# EAGLE design zeta2rework_lw_v26_fixes_wompu (EAGLE 9.0.1)
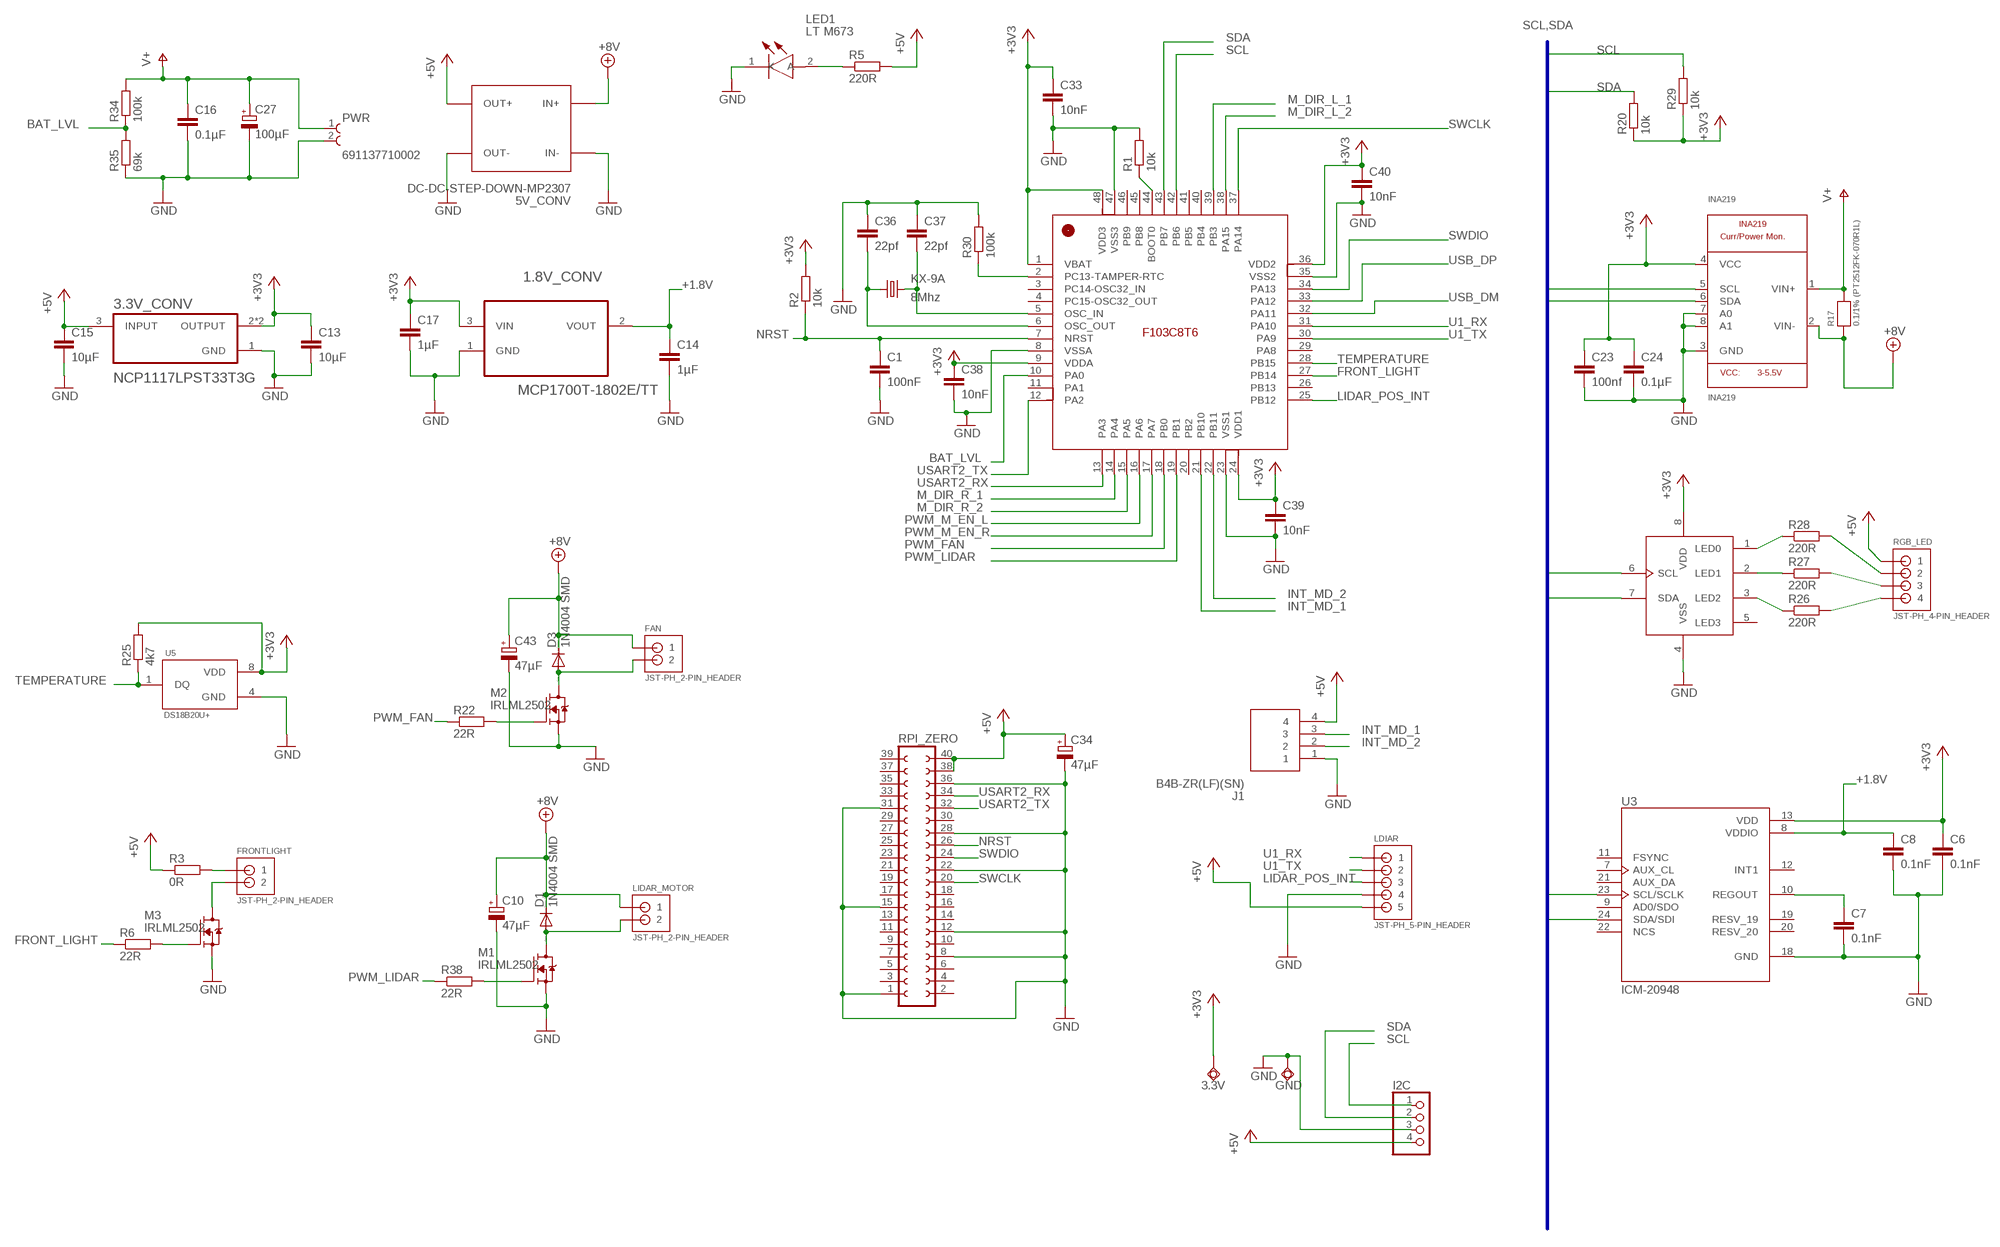
[diagram p0: schematic, sheet 1, part 1 of 2]
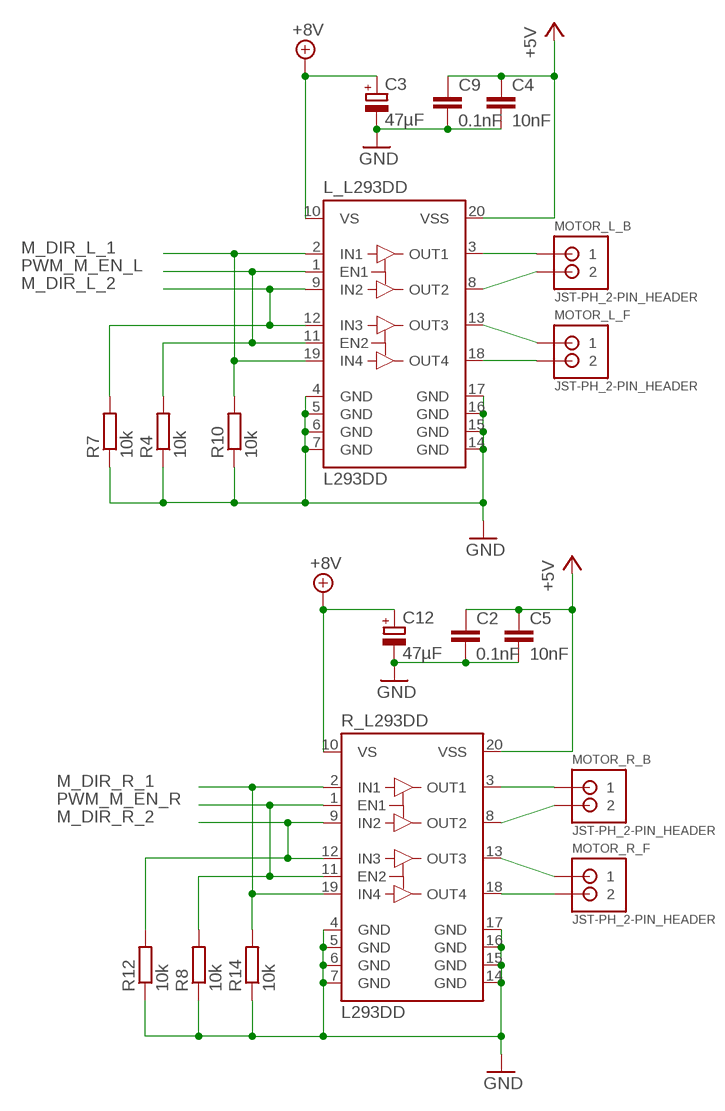
[diagram p1: schematic, sheet 1, part 2 of 2]

## Parts
1.8V_CONV  MCP1700T-1802E/TT  MCP1700T-2102E/TT  [SOT95P237X112-3N]
3.3V  TPSQTP20R  [TP20R]
3.3V_CONV  NCP1117LPST33T3G  [SOT230P700X175-4N]
5V_CONV  DC-DC-STEP-DOWN-MP2307  [DC-DC-STEP-DOWN-MP2307]
C1  100nF  C-EUC1206  [C1206]
C2  0.1nF  C-EUC1206  [C1206]
C3  47µF  CPOL-EUUD-5X5,8  [UD-5X5,8_NICHICON]
C4  10nF  C-EUC1206  [C1206]
C5  10nF  C-EUC1206  [C1206]
C6  0.1nF  C-EUC1206  [C1206]
C7  0.1nF  C-EUC1206  [C1206]
C8  0.1nF  C-EUC1206  [C1206]
C9  0.1nF  C-EUC1206  [C1206]
C10  47µF  CPOL-EUUD-5X5,8  [UD-5X5,8_NICHICON]
C12  47µF  CPOL-EUUD-5X5,8  [UD-5X5,8_NICHICON]
C13  10µF  C-EUC1206  [C1206]
C14  1µF  C-EUC1206  [C1206]
C15  10µF  C-EUC1206  [C1206]
C16  0.1µF  C-EUC1206  [C1206]
C17  1µF  C-EUC1206  [C1206]
C23  100nf  C-EUC1206  [C1206]
C24  0.1µF  C-EUC1206  [C1206]
C27  100µF  CPOL-EUUD-5X5,8  [UD-5X5,8_NICHICON]
C33  10nF  C-EUC1206  [C1206]
C34  47µF  CPOL-EUUD-5X5,8  [UD-5X5,8_NICHICON]
C36  22pf  C-EUC1206  [C1206]
C37  22pf  C-EUC1206  [C1206]
C38  10nF  C-EUC1206  [C1206]
C39  10nF  C-EUC1206  [C1206]
C40  10nF  C-EUC1206  [C1206]
C43  47µF  CPOL-EUUD-5X5,8  [UD-5X5,8_NICHICON]
D1  1N4004 SMD  DIODE-DO214AC  [DO214AC]
D3  1N4004 SMD  DIODE-DO214AC  [DO214AC]
FAN  JST-PH_2-PIN_HEADER  [JST_B2B-PH_HEADER]
FRONTLIGHT  JST-PH_2-PIN_HEADER  [JST_B2B-PH_HEADER]
GND  TPSQTP20R  [TP20R]
I2C  PINHD-1X4  [1X04]
INA219  INA219  [SOT23-8]
J1  B4B-ZR(LF)(SN)  [SHDR4W50P0X150_1X4_750X350X450]
KX-9A  8Mhz  KX-9A  [5.0X3.2_KX-9A]
L_L293DD  L293DD  [SO20]
LDIAR  JST-PH_5-PIN_HEADER  [JST_B5B-PH_HEADER]
LED1  LT M673  LT_M673-N1R2-25  [LTM673-N1R2-25]
LIDAR_MOTOR  JST-PH_2-PIN_HEADER  [JST_B2B-PH_HEADER]
M1  IRLML2502  IRLML2502TRPBF  [SOT23]
M2  IRLML2502  IRLML2502TRPBF  [SOT23]
M3  IRLML2502  IRLML2502TRPBF  [SOT23]
MOTOR_L_B  JST-PH_2-PIN_HEADER  [JST_B2B-PH_HEADER]
MOTOR_L_F  JST-PH_2-PIN_HEADER  [JST_B2B-PH_HEADER]
MOTOR_R_B  JST-PH_2-PIN_HEADER  [JST_B2B-PH_HEADER]
MOTOR_R_F  JST-PH_2-PIN_HEADER  [JST_B2B-PH_HEADER]
PCA9533  PCA9533  [SOIC8]
PWR  691137710002  [691137710002]
R1  10k  R-EU_R0603  [R0603]
R2  10k  R-EU_R0603  [R0603]
R3  0R  R-EU_R0603  [R0603]
R4  10k  R-EU_R0603  [R0603]
R5  220R  R-EU_R0603  [R0603]
R6  22R  R-EU_R0603  [R0603]
R7  10k  R-EU_R0603  [R0603]
R8  10k  R-EU_R0603  [R0603]
R10  10k  R-EU_R0603  [R0603]
R12  10k  R-EU_R0603  [R0603]
R14  10k  R-EU_R0603  [R0603]
R17  0.1/1% (PT2512FK-070R1L)  RESISTOR2512  [2512]
R20  10k  R-EU_R0603  [R0603]
R22  22R  R-EU_R0603  [R0603]
R25  4k7  R-EU_R0603  [R0603]
R26  220R  R-EU_R0603  [R0603]
R27  220R  R-EU_R0603  [R0603]
R28  220R  R-EU_R0603  [R0603]
R29  10k  R-EU_R0603  [R0603]
R30  100k  R-EU_R0603  [R0603]
R34  100k  R-EU_R0603  [R0603]
R35  69k  R-EU_R0603  [R0603]
R38  22R  R-EU_R0603  [R0603]
R_L293DD  L293DD  [SO20]
RGB_LED  JST-PH_4-PIN_HEADER  [JST_B4B-PH_HEADER]
RPI_ZERO  FE20-2  [FE20-2]
STM32F103CB  STM32F103CB  STM32F103C8T6  [LQFP48_7X7MM_0.5MMPP]
U3  ICM-20948  [QFN40P300X300X105-25N]
U5  DS18B20U+  [SOP65P490X95-8N]

## Nets
+1.8V: 1.8V_CONV.2(VOUT) C8.1 C14.1 U3.8(VDDIO)
+3V3: 1.8V_CONV.3(VIN) 3.3V.TP 3.3V_CONV.2(OUTPUT) 3.3V_CONV.4(OUTPUT) C6.1 C13.1 C17.1 C23.1 C24.1 C33.1 C38.1 C39.1 C40.1 INA219.4(VCC) PCA9533.8(VDD) R2.2 R20.1 R25.2 R29.1 STM32F103CB.1(VBAT) STM32F103CB.9(VDDA) STM32F103CB.24(VDD1) STM32F103CB.36(VDD2) STM32F103CB.48(VDD3) U3.13(VDD) U5.8(VDD)
+5V: 3.3V_CONV.3(INPUT) 5V_CONV.OUT+ C2.1 C4.1 C5.1 C9.1 C15.1 C34.+ I2C.4 J1.4 L_L293DD.20(VSS) LDIAR.P5 R3.1 R5.2 R_L293DD.20(VSS) RGB_LED.P1 RPI_ZERO.38 RPI_ZERO.40
+8V: 5V_CONV.IN+ C3.+ C10.+ C12.+ C43.+ D1.C D3.C FAN.P1 INA219.2(VIN-) L_L293DD.10(VS) LIDAR_MOTOR.P1 R17.1 R_L293DD.10(VS)
BAT_LVL: R34.1 R35.2 STM32F103CB.10(PA0)
FRONT_LIGHT: R6.1 STM32F103CB.27(PB14)
GND: 1.8V_CONV.1(GND) 3.3V_CONV.1(GND) 5V_CONV.IN- 5V_CONV.OUT- C1.2 C2.2 C3.- C4.2 C5.2 C6.2 C7.2 C8.2 C9.2 C10.- C12.- C13.2 C14.2 C15.2 C16.2 C17.2 C23.2 C24.2 C27.- C33.2 C34.- C36.1 C37.1 C38.2 C39.2 C40.2 C43.- GND.TP I2C.3 INA219.3(GND) INA219.7(A0) INA219.8(A1) J1.1 L_L293DD.4(GND) L_L293DD.5(GND) L_L293DD.6(GND) L_L293DD.7(GND) L_L293DD.14(GND) L_L293DD.15(GND) L_L293DD.16(GND) L_L293DD.17(GND) LDIAR.P4 LED1.1(K) M1.2(S) M2.2(S) M3.2(S) PCA9533.4(VSS) PWR.2 R1.2 R4.1 R7.1 R8.1 R10.1 R12.1 R14.1 R30.2 R35.1 R_L293DD.4(GND) R_L293DD.5(GND) R_L293DD.6(GND) R_L293DD.7(GND) R_L293DD.14(GND) R_L293DD.15(GND) R_L293DD.16(GND) R_L293DD.17(GND) RPI_ZERO.1 RPI_ZERO.8 RPI_ZERO.12 RPI_ZERO.15 RPI_ZERO.22 RPI_ZERO.28 RPI_ZERO.31 RPI_ZERO.36 STM32F103CB.8(VSSA) STM32F103CB.23(VSS1) STM32F103CB.35(VSS2) STM32F103CB.47(VSS3) U3.18(GND) U5.4(GND)
INT_MD_1: J1.3 STM32F103CB.21(PB10)
INT_MD_2: J1.2 STM32F103CB.22(PB11)
LIDAR_POS_INT: LDIAR.P3 STM32F103CB.25(PB12)
M_DIR_L_1: L_L293DD.2(IN1) L_L293DD.19(IN4) R10.2 STM32F103CB.39(PB3)
M_DIR_L_2: L_L293DD.9(IN2) L_L293DD.12(IN3) R7.2 STM32F103CB.38(PA15)
M_DIR_R_1: R14.2 R_L293DD.2(IN1) R_L293DD.19(IN4) STM32F103CB.14(PA4)
M_DIR_R_2: R12.2 R_L293DD.9(IN2) R_L293DD.12(IN3) STM32F103CB.15(PA5)
N$1: MOTOR_R_B.P2 R_L293DD.8(OUT2)
N$2: MOTOR_R_F.P2 R_L293DD.18(OUT4)
N$3: MOTOR_R_F.P1 R_L293DD.13(OUT3)
N$4: L_L293DD.18(OUT4) MOTOR_L_F.P2
N$5: R1.1 STM32F103CB.44(BOOT0)
N$6: FRONTLIGHT.P1 R3.2
N$7: LED1.2(A) R5.1
N$8: C7.1 U3.10(REGOUT)
N$9: FRONTLIGHT.P2 M3.3(D)
N$10: M3.1(G) R6.2
N$16: L_L293DD.13(OUT3) MOTOR_L_F.P1
N$17: L_L293DD.8(OUT2) MOTOR_L_B.P2
N$18: L_L293DD.3(OUT1) MOTOR_L_B.P1
N$22: PCA9533.3(LED2) R26.1
N$23: PCA9533.2(LED1) R27.1
N$24: PCA9533.1(LED0) R28.1
N$26: MOTOR_R_B.P1 R_L293DD.3(OUT1)
N$31: R26.2 RGB_LED.P4
N$33: R27.2 RGB_LED.P3
N$35: R28.2 RGB_LED.P2
N$37: M2.1(G) R22.2
N$38: M1.1(G) R38.2
N$39: D1.A LIDAR_MOTOR.P2 M1.3(D)
N$46: C36.2 KX-9A.1 STM32F103CB.6(OSC_OUT)
N$47: C37.2 KX-9A.3 STM32F103CB.5(OSC_IN)
N$49: R30.1 STM32F103CB.2(PC13-TAMPER-RTC)
N$55: D3.A FAN.P2 M2.3(D)
NRST: C1.1 R2.1 RPI_ZERO.26 STM32F103CB.7(NRST)
PWM_FAN: R22.1 STM32F103CB.18(PB0)
PWM_LIDAR: R38.1 STM32F103CB.19(PB1)
PWM_M_EN_L: L_L293DD.1(EN1) L_L293DD.11(EN2) R4.2 STM32F103CB.16(PA6)
PWM_M_EN_R: R8.2 R_L293DD.1(EN1) R_L293DD.11(EN2) STM32F103CB.17(PA7)
SCL: I2C.1 INA219.5(SCL) PCA9533.6(SCL) R29.2 STM32F103CB.42(PB6) U3.23(SCL/SCLK)
SDA: I2C.2 INA219.6(SDA) PCA9533.7(SDA) R20.2 STM32F103CB.43(PB7) U3.24(SDA/SDI)
SWCLK: RPI_ZERO.20 STM32F103CB.37(PA14)
SWDIO: RPI_ZERO.24 STM32F103CB.34(PA13)
TEMPERATURE: R25.1 STM32F103CB.28(PB15) U5.1(DQ)
U1_RX: LDIAR.P1 STM32F103CB.31(PA10)
U1_TX: LDIAR.P2 STM32F103CB.30(PA9)
USART2_RX: RPI_ZERO.34 STM32F103CB.13(PA3)
USART2_TX: RPI_ZERO.32 STM32F103CB.12(PA2)
USB_DM: STM32F103CB.32(PA11)
USB_DP: STM32F103CB.33(PA12)
V+: C16.1 C27.+ INA219.1(VIN+) PWR.1 R17.2 R34.2
Unconnected: PCA9533.5(LED3) RPI_ZERO.2 RPI_ZERO.3 RPI_ZERO.4 RPI_ZERO.5 RPI_ZERO.6 RPI_ZERO.7 RPI_ZERO.9 RPI_ZERO.10 RPI_ZERO.11 RPI_ZERO.13 RPI_ZERO.14 RPI_ZERO.16 RPI_ZERO.17 RPI_ZERO.18 RPI_ZERO.19 RPI_ZERO.21 RPI_ZERO.23 RPI_ZERO.25 RPI_ZERO.27 RPI_ZERO.29 RPI_ZERO.30 RPI_ZERO.33 RPI_ZERO.35 RPI_ZERO.37 RPI_ZERO.39 STM32F103CB.3(PC14-OSC32_IN) STM32F103CB.4(PC15-OSC32_OUT) STM32F103CB.11(PA1) STM32F103CB.20(PB2) STM32F103CB.26(PB13) STM32F103CB.29(PA8) STM32F103CB.40(PB4) STM32F103CB.41(PB5) STM32F103CB.45(PB8) STM32F103CB.46(PB9) U3.7(AUX_CL) U3.9(AD0/SDO) U3.11(FSYNC) U3.12(INT1) U3.19(RESV_19) U3.20(RESV_20) U3.21(AUX_DA) U3.22(NCS)

## Buses
SCL,SDA

## Library data of the parts
1.8V_CONV = MCP1700T-2102E_TT:MCP1700T-2102E/TT: Low Quiescent Current LDO; AVAILABILITY: Unavailable; DESCRIPTION: 250mA CMOS LDO, Isupply 1uA and 2% VoutAccuracy; MF: Microchip; MP: MCP1700T-2102E/TT; PACKAGE: SOT-23 Microchip; PRICE: None
3.3V GND = testpad:TPSQ: Test pad
3.3V_CONV = NCP1117LPST33T3G:NCP1117LPST33T3G: None; AVAILABILITY: Unavailable; DESCRIPTION: Linear Voltage Regulator, Positive, LDO, 1.0 A _Fixed and Adjustable_ Vout: 3.3 V; MF: ON Semiconductor; MP: NCP1117LPST33T3G; PACKAGE: SOT-223 ON Semiconductor; PRICE: None
5V_CONV = diy-modules:DC-DC-STEP-DOWN-MP2307: DC/DC Step-Down Regulator based on MP2307DN chip MP2307 datasheet available here: https://cdn-shop.adafruit.com/datasheets/MP2307_r1.9.pdf Click here to find device on ebay.com <http://www.ebay.com/sch/dc+dc+3a+mini+converter>
C1 C2 C4-C9 C13-C17 C23 C24 C33 C36-C40 = rcl:C-EU: CAPACITOR, European symbol; SPICEPREFIX: C
C3 C10 C12 C27 C34 C43 = rcl:CPOL-EU: POLARIZED CAPACITOR, European symbol; SPICEPREFIX: C
D1 D3 = diode:DIODE-: DIODE
FAN FRONTLIGHT LIDAR_MOTOR MOTOR_L_B MOTOR_L_F MOTOR_R_B MOTOR_R_F = srg:JST-PH_2-PIN_HEADER: 2-pin JST PH Shrouded Header, top entry P/N B2B-PH-K-S Mating connector PHR-2 Mating cable assembly: Sparkfun PRT-09914 <http://www.sparkfun.com/products/9914>
I2C = pinhead:PINHD-1X4: PIN HEADER
INA219 = INA219:INA219: INA219 - I2C Current/Power Monitor Voltage Range: 0-26V Accuracy: 0.5% Temperature: -40°C - 125°C; AVAILABILITY: Unavailable; DESCRIPTION: the ina219 is a high-side current shunt and power monitor with an i2c interface. the ina219 monitors both shunt drop ...; MF: Texas Instruments; MP: INA219; PACKAGE: None; PRICE: None
J1 = B4B-ZR(LF)(SN):B4B-ZR(LF)(SN): JST (JAPAN SOLDERLESS TERMINALS) - B4B-ZR(LF)(SN) - HEADER, TOP ENTRY, 4WAY Source: Datasheet <https://componentsearchengine.com/Datasheets/2/B4B-ZR(LF)(SN).pdf>; DESCRIPTION: JST (JAPAN SOLDERLESS TERMINALS) - B4B-ZR(LF)(SN) - HEADER, TOP ENTRY, 4WAY; FARNELL_PART_NUMBER: 9491791; HEIGHT: 4.5mm; MANUFACTURER_NAME: JST (JAPAN SOLDERLESS TERMINALS); MANUFACTURER_PART_NUMBER: B4B-ZR(LF)(SN)
KX-9A = crystal-geyer_V1_0:KX: Quartz Crystals (MHz) SMD: KX - Serie Model Size l/w/h [mm] Frequency Range Frequency Stability Temp. Range [°C] Load Capacitance AECQ 200 availabel Datasheet KX-4 KX-5 KX-6 KX-7 KX-9A KX-9B KX-12A KX-12B KX-13 KX-20 KX-K KX-KS 1.6/1.2/0.3 2.0/1.6/0.45 2.5/2.0/0.55 3.2/2.5/0.8 5.0/3.2/1.0 5.0/3.2/1.1 6.0/3.5/1.1 6.0/3.5/1.0 7.0/5.0 /1.3 11.6/5.5/1.6 12.3/4.5/4.2 12.3/4.5/3.2 24.0 ~ 80.0 MHz 16.0 ~ 80.0 MHz 12.0 ~ 80.0 MHz 8.0 ~ 60.0 MHz 7,68 ~ 300,0 MHz 8,0 ~ 50,0 MHz 8,0 ~ 150,0 MHz 8,0 ~ 50,0 MHz 6,0 ~ 160,0 MHz 3,579 ~ 25,0 MHz 3,579 ~ 70,0 MHz 3,579 ~ 70,0 MHz ±10 … ±50ppm ±10 … ±50ppm ±10 … ±50ppm ±10 … ±50ppm ±10 … ±50ppm ±10 … ±50ppm ±10 … ±50ppm ±10 … ±50ppm ±10 … ±50ppm ±50ppm ±10 … ±50ppm ±10 … ±50ppm (*) -40°C …+85°C (*) -40°C …+125°C (*) -40°C …+125°C (*) -40°C …+125°C (*) -40°C …+105°C (*) -40°C …+105°C (*) -40°C …+125°C (*) -40°C …+105°C (*) -40°C …+105°C (*) -40°C …+105°C (*) -40°C …+85°C (*) -40°C …+85°C 8, 8…16 8, 8…16 10, 8…16 12, 7…20 16, 10…20 16, 10…20 16, 10…20 16, 12…20 16, 12…20 16, 12…20 16, 12…30 16, 12…30 - yes yes yes - - - - - - - - KX-4.pdf <http://www.geyer-electronic.de/uploads/tx_userartikelfrequenz/GEYER-KX-4.pdf> KX-5.pdf <http://www.geyer-electronic.de/uploads/tx_userartikelfrequenz/GEYER-KX-5.pdf> KX-6.pdf <http://www.geyer-electronic.de/uploads/tx_userartikelfrequenz/GEYER-KX-6.pdf> KX-7.pdf <http://www.geyer-electronic.de/uploads/tx_userartikelfrequenz/GEYER-KX-7.pdf> KX-9A.pdf <http://www.geyer-electronic.de/uploads/tx_userartikelfrequenz/GEYER-KX-9A.pdf> KX-9B.pdf <http://www.geyer-electronic.de/uploads/tx_userartikelfrequenz/GEYER-KX-9B.pdf> KX-12A.pdf <http://www.geyer-electronic.de/uploads/tx_userartikelfrequenz/GEYER-KX-12A.pdf> KX-12B.pdf <http://www.geyer-electronic.de/uploads/tx_userartikelfrequenz/GEYER-KX-12B.pdf> KX-13.pdf <http://www.geyer-electronic.de/uploads/tx_userartikelfrequenz/GEYER-KX-13.pdf> KX-20.pdf <http://www.geyer-electronic.de/uploads/tx_userartikelfrequenz/GEYER-KX-20.pdf> KX-K.pdf <http://www.geyer-electronic.de/uploads/tx_userartikelfrequenz/GEYER-KX-K.pdf> KX-KS.pdf <http://www.geyer-electronic.de/uploads/tx_userartikelfrequenz/GEYER-KX-KS.pdf> <http://www.geyer-electronic.de/fileadmin/template/img/logo-geyer-electronic.png> Details see: http://www.geyer-electronic.de/Frequenz-Produkte.9.0.html Created 2016-06-07, Hans Locher 2016 (C) Geyer Quartz Technology KX4,KX5,KX6,KX7,KX9A,KX9B,KX12A,KX12B,KX13,KX20,KXK,KXKS;1612;2016;2520;3225;5032;6035;7050;11655;12345;1,6x1,2;2,0x1,6;2,5x2,0;3,2x2,5;5,0x3,2;6,0x3,5;7,0x5,0;11,6x5,5;12,3x4,5;12,3x4,5;1.6x1.2;2.0x1.6;2.5x2.0;3.2x2.5;5.0x3.2;6.0x3.5;7.0x5.0;11.6x5.5;12.3x4.5;12.3x4.5;
L_L293DD R_L293DD = st-microelectronics:L293DD: PUSH-PULL FOUR CHANNEL DRIVER WITH DIODES Source: http://www.st.com/stonline/books/pdf/docs/1330.pdf; OC_FARNELL: unknown
LDIAR = srg:JST-PH_5-PIN_HEADER: 5-pin JST PH Shrouded Header, top entry P/N B5B-PH-K-S Mating connector PHR-5 Mating cable assembly: Sparkfun PRT-09917 <http://www.sparkfun.com/products/9917>
LED1 = LT_M673-N1R2-25:LT_M673-N1R2-25: Osram Opto LT M673-N1R2-25, Mini TOPLED Series Green LED, 529 nm,, Rectangle Lens SMD Package Source: Datasheet <https://www.osram-os.com/Graphics/XPic0/00252812_0.pdf/LT M673.pdf>; DESCRIPTION: Osram Opto LT M673-N1R2-25, Mini TOPLED Series Green LED, 529 nm,, Rectangle Lens SMD Package; HEIGHT: mm; MANUFACTURER_NAME: OSRAM Opto Semiconductors; MANUFACTURER_PART_NUMBER: LT M673-N1R2-25; MOUSER_PART_NUMBER: 720-LTM673N1R225Z; MOUSER_PRICE-STOCK: https://www.mouser.com/Search/Refine.aspx?Keyword=720-LTM673N1R225Z; RS_PART_NUMBER: 9133231; RS_PRICE-STOCK: http://uk.rs-online.com/web/p/products/9133231
M1-M3 = IRLML2502TRPBF:IRLML2502TRPBF; AVAILABILITY: Unavailable; DESCRIPTION: Single N-Channel 20 V 0.08 Ohm 12 nC 1.25 W Silicon SMT Mosfet - SOT-23; MF: Infineon; MP: IRLML2502TRPBF; PACKAGE: SOT-23-3 Infineon; PRICE: None
PCA9533 = adam - ics:PCA9533: PCA9533D/01: LED driver and dimmer 4 channel, PWM @ 8 bit resolution 25mA / channel sink external resistors per LED I2C protocol @ 400kHz (fast) digikey: 568-3372-5-ND, 8-SOIC, $1.92
PWR = term block:691137710002: SERIE 1377 - 5.00 MM - HORIZONTAL CABLE ENTRY WITH PRESSURE CLAMP - GLOW WIRE PLASTIC - WR-TBL <http://katalog.we-online.de/media/images/v2/Family_WR-TBL1_6911377100xx.jpg> Details see: http://katalog.we-online.de/en/em/TBL_5_00_1377_HORIZONTAL_ENTRY_W_PRESSURE_CLAMP_GLOW_WIRE_6911377100xx Created by Yingchun,Shan 2016(C) Wurth Elektronik; AVAILABILITY: Unavailable; DESCRIPTION: Term Block 2pos Side Entry 5mm; MF: Wurth Electronics; MP: 691137710002; PACKAGE: None; PRICE: None
R1-R8 R10 R12 R14 R20 R22 R25-R30 R34 R35 R38 = rcl:R-EU_: RESISTOR, European symbol; SPICEPREFIX: R
R17 = microbuilder:RESISTOR: Resistors 0402 - 0402 Surface Mount Package 22 Ohm 1% 1/16W [Digikey: 311-22.0LRTR-ND] 33 Ohm 5% 1/16W 1.0K 5% 1/16W 1.5K 5% 1/16W 2.0K 1% 1/16W 10.0K 1% 1/16W [Digikey: 311-10.0KLRTR-ND] 10.0K 5% 1/16W [Digikey: RMCF0402JT10K0TR-ND] 12.1K 1% 1/16W [Digikey: 311-22.0LRTR-ND] 100.0K 5% 1/16W 0603 - 0603 Surface Mount Package 0 Ohm 1/10 Watt 1% Resistor 15 Ohm 1/10 Watt 1% Resistor 33 Ohm 1/10 Watt 1% Resistor 49.9 Ohm 1/10 Watt 1% Resistor 100 Ohm 1/10 Watt 1% Resistor 150 Ohm 1/10 Watt 1% Resistor 240 Ohm 1/10 Watt 1% Resistor 390 Ohm 1/10 Watt 1% Resistor 560 Ohm 1/10 Watt 1% Resistor 680 Ohm 1/10 Watt 1% Resistor 750 Ohm 1/10 Watt 1% Resistor 1.0K Ohm 1/10 Watt 1% Resistor 1.5K Ohm 1/10 Watt 1% Resistor 2.0K Ohm 1/10 Watt 1% Resistor 2.2K Ohm 1/10 Watt 1% Resistor 3.3K Ohm 1/10 Watt 1% Resistor 4.7K Ohm 1/10 Watt 1% Resistor 10.0K Ohm 1/10 Watt 1% Resistor 12.0K Ohm 1/10 Watt 1% Resistor 12.1K Ohm 1/10 Watt 1% Resistor 20.0K Ohm 1/10 Watt 1% Resistor 33.0K Ohm 1/10 Watt 1% Resistor 100.0K Ohm 1/10 Watt 1% Resistor 0805 - 0805 Surface Mount Package 0 Ohm 1/8 Watt 1% Resistor 33 Ohm 1/8 Watt 1% Resistor 100 Ohm 1/8 Watt 1% Resistor 150 Ohm 1/8 Watt 1% Resistor 200 Ohm 1/8 Watt 1% Resistor 240 Ohm 1/8 Watt 1% Resistor 330 Ohm 1/8 Watt 1% Resistor 390 Ohm 1/8 Watt 1% Resistor 470 Ohm 1/8 Watt 1% Resistor 1.0K Ohm 1/8 Watt 1% Resistor 1.5K Ohm 1/8 Watt 1% Resistor 2.0K Ohm 1/8 Watt 1% Resistor 4.7K Ohm 1/8 Watt 1% Resistor 5.1K Ohm 1/8 Watt 1% Resistor 5.6K Ohm 1/8 Watt 1% Resistor 10.0K Ohm 1/8 Watt 1% Resistor 22.0K Ohm 1/8 Watt 1% Resistor 33.0K Ohm 1/8 Watt 1% Resistor 100K Ohm 1/8 Watt 1% Resistor 1206 - 1206 Surface Mount Package 2012 - 2010 Surface Mount Package 0.11 Ohm 1/2 Watt 1% Resistor - Digikey: RHM.11UCT-ND
RGB_LED = srg:JST-PH_4-PIN_HEADER: 4-pin JST PH Shrouded Header, top entry P/N B4B-PH-K-S Mating connector PHR-4 Mating cable assembly: Sparkfun PRT-09916 <http://www.sparkfun.com/products/9916>
RPI_ZERO = con-lsta:FE20-2: FEMALE HEADER; OC_FARNELL: unknown; OC_NEWARK: unknown
STM32F103CB = STM32F103C8T6:STM32F103C8T6; AVAILABILITY: Good; DESCRIPTION: Mainstream Performance line, ARM Cortex-M3 MCU with 64 Kbytes Flash, 72 MHz CPU, motor control, USB and CAN; MF: STMicroelectronics; MP: STM32F103C8T6; PACKAGE: LQFP-48 STMicroelectronics; PRICE: 3.83 USD
U3 = ICM-20948:ICM-20948: Axis=3 Axis Gyro+3 Axis Accel+Compass. Pin For Pin With m; AVAILABILITY: Unavailable; DESCRIPTION: 9 Axis=3 Axis Gyro+3 Axis Accel+Compass. Pin For Pin With m; MF: TDK InvenSense; MP: ICM-20948; PACKAGE: QFN-24 InvenSense; PRICE: None
U5 = DS18B20U_:DS18B20U+: Board Mount Temperature Sensors Prgmble Resolution 1-Wire Parasite Pwr; AVAILABILITY: Unavailable; DESCRIPTION: Date Code: 1043+; RoHS Compliant: Yes;; MF: Maxim; MP: DS18B20U+; PACKAGE: TSSOP-8 Chip Coolers; PRICE: None

## Net classes
0 default: clearance 0.152 mm

## Board
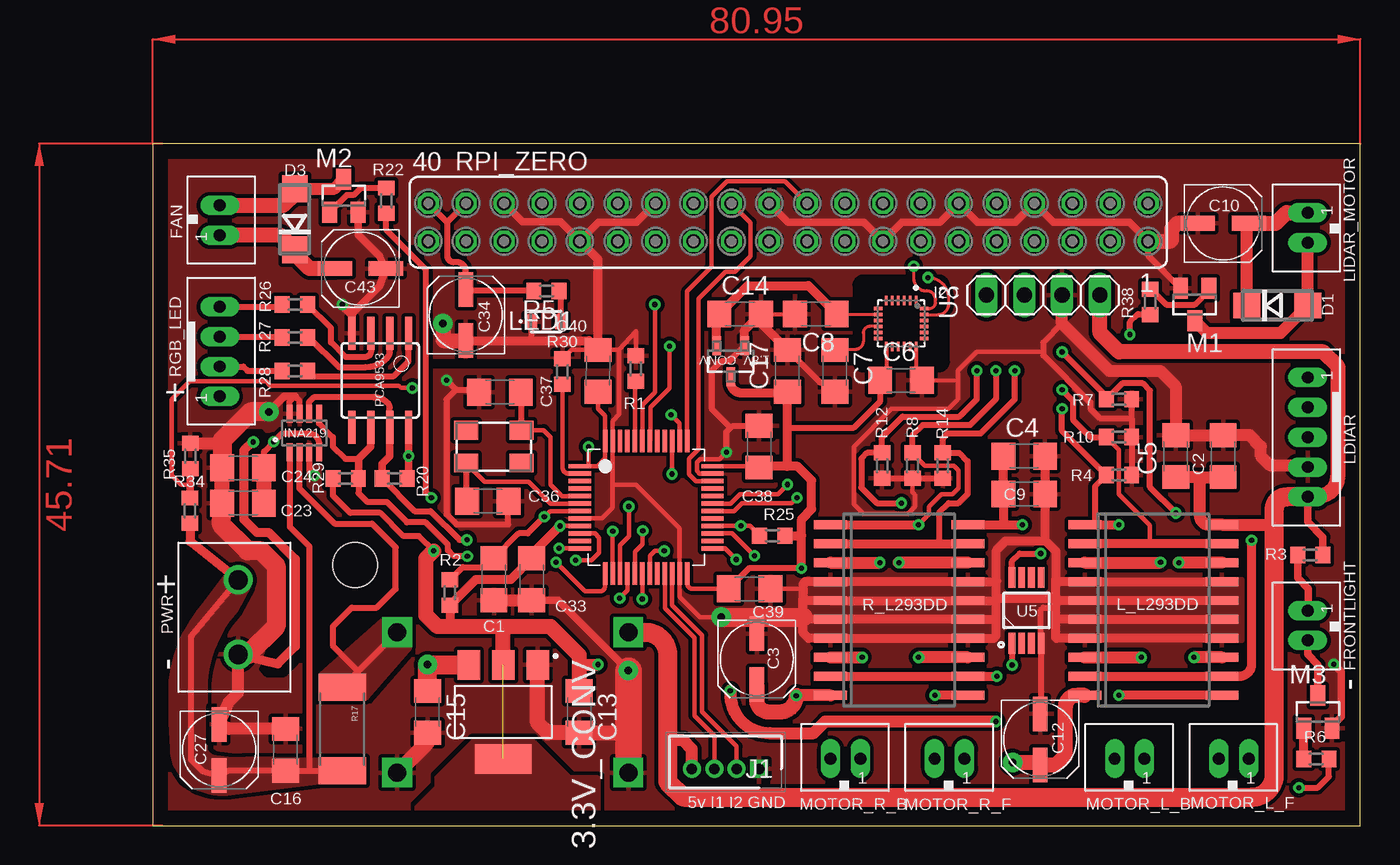
[diagram p2: board, top side]
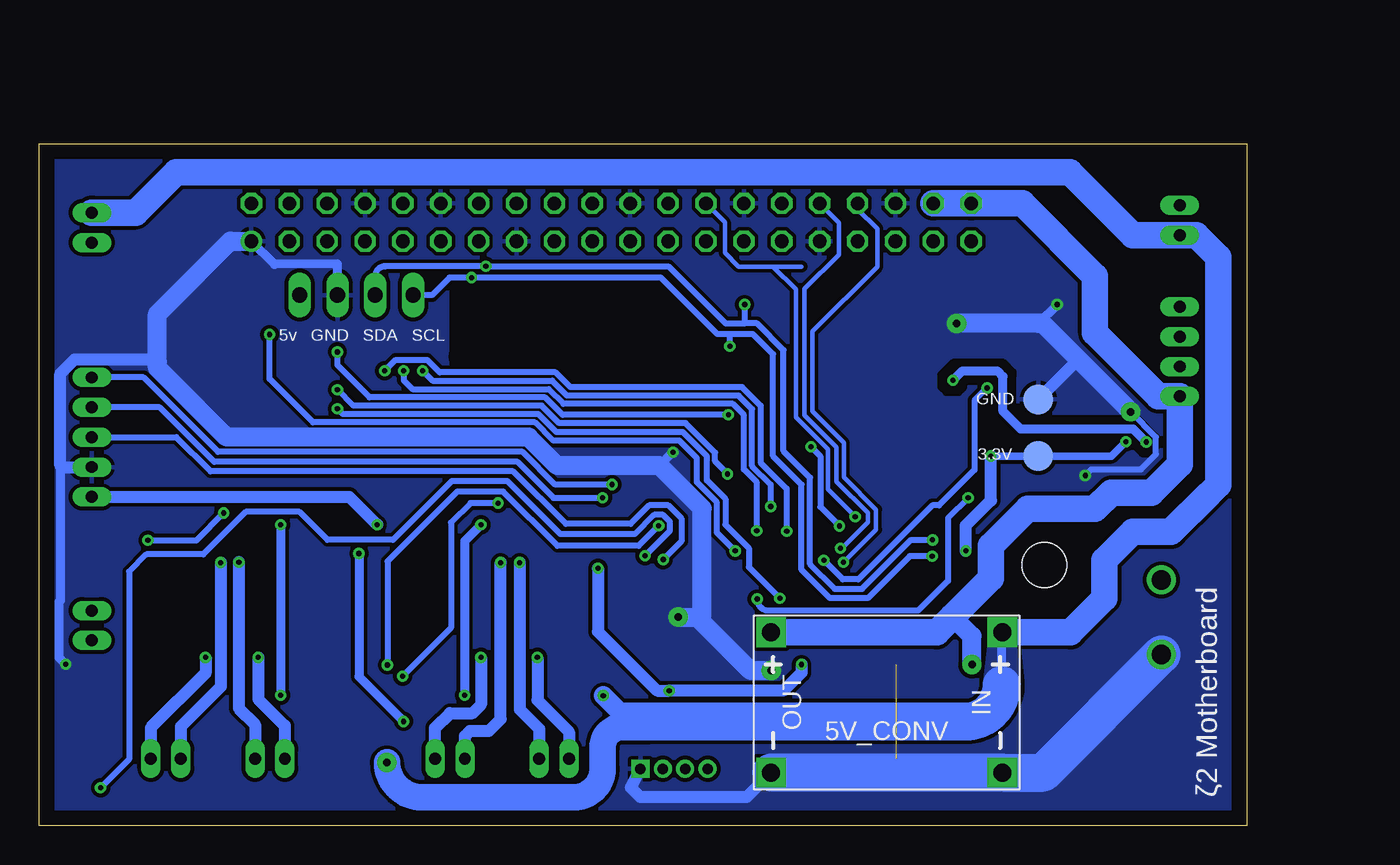
[diagram p3: board, bottom side, seen from below]

Size 80.95 x 45.71 mm. Coordinates in mm from the lower left corner, seen from the top.
Outline: 0,0 80.95,0 80.95,45.71 0,45.71 0,0
Copper layers (1*16): Top 0.035mm / dielectric 1.5mm / Bottom 0.035mm
Design rules "default": minimum track width 6mil, minimum drill 0.35mm, track to track 6mil, track to pad 6mil, pad to pad 6mil, via to via 6mil, smd to smd 6mil, copper to edge 40mil, drill to drill 6mil, minimum pad ring 10mil, minimum via ring 8mil, stop-mask expansion 4mil, vias tented up to drill 0mil, thermal gap 10mil
Holes 3 mm at 13.56,17.48

### Footprints (pad centres in the part's own frame; a part is rotated, then mirrored left to right if it is on the bottom)
SOT95P237X112-3N = smd 0.559 x 1.27: 1 -0.94,-1.041; 2 0.94,-1.041; 3 0,1.041
TP20R = smd 2 x 2: TP 0,0
SOT230P700X175-4N = smd 2 x 1.5: 1 -3.15,2.3; 2 -3.15,0; 3 -3.15,-2.3 | smd 2 x 3.8: 4 3.15,0
DC-DC-STEP-DOWN-MP2307 = drill 1.2 pad 2 square: IN+ -7.747,-4.699; IN- -7.747,4.699; OUT+ 7.747,-4.699; OUT- 7.747,4.699
C1206 = smd 1.6 x 1.8: 1 -1.4,0; 2 1.4,0
UD-5X5,8_NICHICON = smd 2.3 x 1: + 1.725,0; - -1.7,0
DO214AC = smd 1.8 x 1.7: A 2.05,0; C -2.05,0
JST_B2B-PH_HEADER = drill 0.8 long: P1 1.075,0.048; P2 -0.925,0.048
1X04 = drill 1.016 long: 1 -3.81,0; 2 -1.27,0; 3 1.27,0; 4 3.81,0
SOT23-8 = smd 0.4 x 1.2: 1 -0.975,-1.3; 2 -0.325,-1.3; 3 0.325,-1.3; 4 0.975,-1.3; 5 0.975,1.3; 6 0.325,1.3; 7 -0.325,1.3; 8 -0.975,1.3
SHDR4W50P0X150_1X4_750X350X450 = drill 0.7 pad 1.1 square: 1 0,0 | drill 0.7 pad 1.1: 2 -1.5,0; 3 -3,0; 4 -4.5,0
5.0X3.2_KX-9A = smd 1.6 x 1.25: 1 -1.85,-1.1; 2 1.85,-1.1; 3 1.85,1.1; 4 -1.85,1.1
SO20 = smd 0.6 x 2.2: 1 -5.715,-4.6; 2 -4.445,-4.6; 3 -3.175,-4.6; 4 -1.905,-4.6; 5 -0.635,-4.6; 6 0.635,-4.6; 7 1.905,-4.6; 8 3.175,-4.6; 9 4.445,-4.6; 10 5.715,-4.6; 11 5.715,4.6; 12 4.445,4.6; 13 3.175,4.6; 14 1.905,4.6; 15 0.635,4.6; 16 -0.635,4.6; 17 -1.905,4.6; 18 -3.175,4.6; 19 -4.445,4.6; 20 -5.715,4.6
JST_B5B-PH_HEADER = drill 0.8 long: P1 4,0.048; P2 2,0.048; P3 0,0.048; P4 -2,0.048; P5 -4,0.048
LTM673-N1R2-25 = smd 0.8 x 1: 1 -1,0; 2 1,0
SOT23 = smd 1 x 1.4: 1 -0.95,-1.1; 2 0.95,-1.1; 3 0,1.1
SOIC8 = smd 0.5 x 2.2: 1 -1.905,-3.154; 2 -0.645,-3.154; 3 0.625,-3.154; 4 1.895,-3.154; 5 1.905,3.154; 6 0.635,3.154; 7 -0.635,3.154; 8 -1.905,3.154
691137710002 = drill 1.3: 1 -2.5,0; 2 2.5,0
R0603 = smd 1 x 1.1: 1 -0.85,0; 2 0.85,0
2512 = smd 1.8 x 3.2: 1 -2.8,0; 2 2.8,0
JST_B4B-PH_HEADER = drill 0.8 long: P1 2.98,0.048; P2 0.98,0.048; P3 -1.02,0.048; P4 -3.02,0.048
FE20-2 = drill 0.914: 1 -24.13,1.27 | drill 0.914 octagon: 2 -24.13,-1.27; 3 -21.59,1.27; 4 -21.59,-1.27; 5 -19.05,1.27; 6 -19.05,-1.27; 7 -16.51,1.27; 8 -16.51,-1.27; 9 -13.97,1.27; 10 -13.97,-1.27; 11 -11.43,1.27; 12 -11.43,-1.27; 13 -8.89,1.27; 14 -8.89,-1.27; 15 -6.35,1.27; 16 -6.35,-1.27; 17 -3.81,1.27; 18 -3.81,-1.27; 19 -1.27,1.27; 20 -1.27,-1.27; 21 1.27,1.27; 22 1.27,-1.27; 23 3.81,1.27; 24 3.81,-1.27; 25 6.35,1.27; 26 6.35,-1.27; 27 8.89,1.27; 28 8.89,-1.27; 29 11.43,1.27; 30 11.43,-1.27; 31 13.97,1.27; 32 13.97,-1.27; 33 16.51,1.27; 34 16.51,-1.27; 35 19.05,1.27; 36 19.05,-1.27; 37 21.59,1.27; 38 21.59,-1.27; 39 24.13,1.27; 40 24.13,-1.27
LQFP48_7X7MM_0.5MMPP = smd 1.5 x 0.3: 1 -4.45,2.75; 2 -4.45,2.25; 3 -4.45,1.75; 4 -4.45,1.25; 5 -4.45,0.75; 6 -4.45,0.25; 7 -4.45,-0.25; 8 -4.45,-0.75; 9 -4.45,-1.25; 10 -4.45,-1.75; 11 -4.45,-2.25; 12 -4.45,-2.75; 25 4.45,-2.75; 26 4.45,-2.25; 27 4.45,-1.75; 28 4.45,-1.25; 29 4.45,-0.75; 30 4.45,-0.25; 31 4.45,0.25; 32 4.45,0.75; 33 4.45,1.25; 34 4.45,1.75; 35 4.45,2.25; 36 4.45,2.75 | smd 0.3 x 1.5: 13 -2.75,-4.45; 14 -2.25,-4.45; 15 -1.75,-4.45; 16 -1.25,-4.45; 17 -0.75,-4.45; 18 -0.25,-4.45; 19 0.25,-4.45; 20 0.75,-4.45; 21 1.25,-4.45; 22 1.75,-4.45; 23 2.25,-4.45; 24 2.75,-4.45; 37 2.75,4.45; 38 2.25,4.45; 39 1.75,4.45; 40 1.25,4.45; 41 0.75,4.45; 42 0.25,4.45; 43 -0.25,4.45; 44 -0.75,4.45; 45 -1.25,4.45; 46 -1.75,4.45; 47 -2.25,4.45; 48 -2.75,4.45
QFN40P300X300X105-25N = smd 0.64 x 0.22: 1 -1.545,1; 2 -1.545,0.6; 3 -1.545,0.2; 4 -1.545,-0.2; 5 -1.545,-0.6; 6 -1.545,-1; 13 1.545,-1; 14 1.545,-0.6; 15 1.545,-0.2; 16 1.545,0.2; 17 1.545,0.6; 18 1.545,1 | smd 0.22 x 0.64: 7 -1,-1.545; 8 -0.6,-1.545; 9 -0.2,-1.545; 10 0.2,-1.545; 11 0.6,-1.545; 12 1,-1.545; 19 1,1.545; 20 0.6,1.545; 21 0.2,1.545; 22 -0.2,1.545; 23 -0.6,1.545; 24 -1,1.545
SOP65P490X95-8N = smd 1.4 x 0.45: 1 -2.2,0.975; 2 -2.2,0.325; 3 -2.2,-0.325; 4 -2.2,-0.975; 5 2.2,-0.975; 6 2.2,-0.325; 7 2.2,0.325; 8 2.2,0.975

### Placement (x,y rotation side)
1.8V_CONV  38.73,31.12 180 top
3.3V  13.97,24.77 0 bottom
3.3V_CONV  23.5,7.62 270 top
5V_CONV  24.13,8.25 180 bottom
C1  22.86,16.51 270 top
C2  71.76,24.77 90 top
C3  40.49,11.18 270 top
C4  58.42,24.77 0 top
C5  68.58,24.77 90 top
C6  50.16,29.84 0 top
C7  45.72,30.48 270 top
C8  44.45,34.29 180 top
C9  58.42,22.23 0 top
C10  71.76,40.36 0 top
C12  59.49,5.79 270 top
C13  28.58,7.62 270 top
C14  39.37,34.29 0 top
C15  18.42,7.62 270 top
C16  8.89,5.08 90 top
C17  42.54,30.48 90 top
C23  6.05,21.62 180 top
C24  6.05,23.98 180 top
C27  4.45,5.08 270 top
C33  25.4,16.51 270 top
C34  20.98,34.21 90 top
C36  22.45,21.74 180 top
C37  23.27,29.06 0 top
C38  40.64,25.4 90 top
C39  40,15.88 0 top
C40  29.85,30.48 89.8 top
C43  13.92,37.34 180 top
D1  75.39,34.85 0 top
D3  9.53,40.64 90 top
FAN  4.45,40.64 270 top
FRONTLIGHT  77.47,13.34 90 top
GND  13.97,28.58 0 bottom
I2C  59.69,35.56 0 top
INA219  10.16,26.31 0 top
J1  40.64,3.81 0 top
KX-9A  22.86,25.4 0 top
L_L293DD  67.08,14.45 270 top
LDIAR  77.47,26.04 90 top
LED1  26.37,33.78 0 top
LIDAR_MOTOR  77.47,40.01 90 top
M1  69.85,34.92 180 top
M2  12.8,42.21 0 top
M3  78.11,7.62 0 top
MOTOR_L_B  65.41,4.44 0 top
MOTOR_L_F  72.39,4.44 0 top
MOTOR_R_B  46.35,4.44 0 top
MOTOR_R_F  53.34,4.44 0 top
PCA9533  15.24,29.84 180 top
PWR  5.71,13.97 270 top
R1  32.38,30.63 90 top
R2  19.91,15.62 270 top
R3  77.6,18.14 180 top
R4  64.77,23.5 180 top
R5  26.39,35.84 180 top
R6  78,4.47 180 top
R7  64.77,28.58 180 top
R8  50.93,24.13 90 top
R10  64.77,26.04 180 top
R12  48.89,24.13 90 top
R14  52.96,24.13 90 top
R17  12.7,6.48 270 top
R20  16.21,23.27 180 top
R22  15.65,41.88 90 top
R25  41.53,19.43 0 top
R26  9.53,34.92 180 top
R27  9.53,32.72 180 top
R28  9.53,30.48 180 top
R29  12.93,23.27 0 top
R30  27.46,30.43 90 top
R34  2.49,21.11 270 top
R35  2.51,24.77 270 top
R38  66.85,35.1 90 top
R_L293DD  50.04,14.45 270 top
RGB_LED  4.45,31.75 270 top
RPI_ZERO  42.6,40.44 180 top
STM32F103CB  33.07,21.34 0 top
U3  50.16,33.66 270 top
U5  58.57,14.43 90 top

### Tracks (layer width: path | path; a pad name or v marks a point on that pad's centre or on a via)
+1.8V
  Top 0.203: U3.8 45.88,34.26
  Top 0.254: C8.1 45.88,34.26
  Top 0.61: 1.8V_CONV.2 37.79,34.12 arc-90 C14.1 39.88,36.2 43.95,36.2 C8.1
+3V3  (via drill 0.35)  (1 unrouted)
  Top 0.254: U3.13 49.16,30.24 C6.1
  Top 0.305: STM32F103CB.1 29.21,24.09 | 29.21,24.09 29.8,24.09 30.32,24.61 STM32F103CB.48 30.32,27.46 29.84,27.95 C40.1 | STM32F103CB.9 v27.31,20.09 | v29.21,25.4 29.21,24.09 | STM32F103CB.36 40.55,24.09 C38.1 | STM32F103CB.24 35.82,16.25 arc90 36.2,15.88 C39.1
  Top 0.406: U5.8 57.6,17.72 58.11,18.24 v59.51,18.24 | C24.1 7.44,25.07 v8.1,25.73 8.66,26.29 10.46,26.29 arc-90 11.13,25.62 INA219.4 | 22.96,13.44 22.86,13.34 | C39.1 40,17.27 43.23,17.27 v43.48,17.25 | v18.82,18.41 17.83,19.41 16.79,19.41 15.24,20.96 13.23,20.96 12.08,22.11 R29.1 | C6.1 48.77,28.45 46.99,26.67 42.54,26.67
  Top 0.508: PCA9533.8 v17.15,24.77 17.15,23.36 R20.1
  Top 0.61: v43.48,17.25 43.48,19.43 | 43.48,19.43 43.48,20.55 44.17,21.23 44.17,23.14 43.22,24.09 42.54,24.09 | R25.2 43.48,19.43 | 20.09,14.77 R2.2 | R2.2 19.91,13.56 19.69,13.34 | 42.54,24.09 40.55,24.09 | 42.54,24.09 42.54,26.67 C17.1 arc-90 42.47,29.01 39.45,29.01 arc-90 38.73,29.72 1.8V_CONV.3 | R2.2 21.65,16.51 24,16.51 C33.1 25.4,18.18 v27.31,20.09
  Top 0.813: 28.58,10.8 v29.85,10.8 | v56.52,6.99 45.09,6.99 44.3,6.2 41.35,6.2 arc-90 38.71,8.84 v38.71,9.04
  Top 1.016: C23.1 C24.1 | C13.1 28.58,10.8 28.58,11.43 26.67,13.34 23.5,13.34 | 23.5,13.34 22.86,13.34 19.69,13.34 19.08,13.34 18.31,14.1 18.31,17.91 v18.82,18.41 | 3.3V_CONV.2 23.5,13.34
  Bottom 0.406: v27.31,20.09 28.58,21.36 28.58,24.77 v29.21,25.4
  Bottom 0.508: v17.15,24.77 3.3V.TP 9.07,24.77 v8.1,25.73
  Bottom 0.61: v59.51,18.24 59.51,9.98 v56.52,6.99
  Bottom 0.813: v43.48,17.25 43.48,13 39.52,9.04 v38.71,9.04 31.06,9.04 29.85,10.26 v29.85,10.8 | v18.82,18.41 18.82,20.12 17.15,21.79 v17.15,24.77
  pour Top (isolate 0.406, rank 2, no thermals): 21.59,5.71 19.05,3.17 19.05,2.54 16.51,0 29.85,0 29.85,3.17 27.94,3.17 25.4,5.71
+5V  (via drill 0.35, 0.5 pad 1.3)
  Top 0.406: 18.47,41.61 RPI_ZERO.40 19.74,40.44 | RPI_ZERO.38 19.74,40.44 | 19.74,40.44 19.74,38.2 arc90 20.17,37.77 20.37,37.77 arc-90 20.98,37.16 C34.+ 21.08,35.84 R5.2
  Top 0.508: R3.1 78.45,19.34 77.42,20.37 LDIAR.P5
  Top 0.61: C4.1 C9.1 57.02,20.3 57.15,20.17 | R_L293DD.20 57.15,20.17 | 57.15,20.17 v58.29,20.17
  Top 0.813: 69.85,23.37 C5.1 | 69.85,23.37 C2.1 | 75.08,21.65 75.23,21.8 75.18,21.21 | 75.18,20.17 L_L293DD.20 70.82,20.17 arc-90 70.21,20.78 70.21,23.01 arc90 69.85,23.37 | J1.4 36.14,5.13 35.56,5.71 34.52,5.71
  Top 1.016: I2C.4 63.5,33.02 64.77,31.75 78.49,31.75 79.43,30.81 79.43,23.37 arc-90 78.16,22.1 77.48,22.1 arc90 LDIAR.P5 | 76.71,22.1 77.36,22.1 LDIAR.P5 | LDIAR.P5 76.7,22.04 | 76.65,22.04 LDIAR.P5
  Top 1.27: LDIAR.P5 76.01,22.04 arc90 75.18,21.21 75.18,20.17 75.18,3.4 arc-90 73.69,1.91 35.56,1.91 34.52,2.94 34.52,5.71 34.52,11.45 arc90 33.02,12.95 5V_CONV.OUT+ | C15.1 v18.42,10.8 18.44,10.77 3.3V_CONV.3
  Bottom 0.813: LDIAR.P5 60.16,22.04 v58.29,20.17
  Bottom 1.27: v18.42,10.8 18.42,12.7 19.72,14.01
  Bottom 1.778: RPI_ZERO.38 RPI_ZERO.40 15.04,41.71 10.16,36.83 10.16,33.02 5.91,28.77 RGB_LED.P1 4.49,24.21 6.38,22.33 9.07,22.33 10.16,21.23 14.67,21.23 17.15,18.76 17.15,16.59 19.72,14.01 20.78,12.95 5V_CONV.OUT+
+8V  (via drill 0.35, 0.5 pad 1.3)
  Top 0.406: INA219.2 9.83,22.58 12.17,20.25 14.69,20.25 16.28,18.65 16.28,15.88 15.01,14.61 13.33,14.61 12.06,13.34 12.06,12.07 13.78,10.35 | R17.1 13.78,10.35 | 13.78,10.35 5V_CONV.IN+
  Top 0.813: 77.34,41 LIDAR_MOTOR.P1 76.01,41.08 | R_L293DD.10 43.16,8.74 v43.13,8.71 | D1.C 73.34,40.22 C10.+
  Top 1.016: FAN.P1 8.58,39.56 D3.C 9.53,38.31 10.5,37.34 C43.+ | C3.+ 40.49,8.41 arc90 41.27,7.62 42.04,7.62 arc90 43.16,8.74 | v57.63,4.24 59.01,4.24 C12.+ 60.58,4.07 61.19,4.67 61.19,7.98 arc-90 61.95,8.74 L_L293DD.10 | C10.+ 75.29,40.36 76.01,41.08 77.25,41.08 77.34,41
  Bottom 0.61: 16.41,9.42 16.41,12.93 arc90 5V_CONV.IN+
  Bottom 1.27: v43.13,8.71 42.04,7.62 40,7.62 40,6.99
  Bottom 1.778: LIDAR_MOTOR.P1 74.49,41.08 71.77,43.8 11.86,43.8 7.62,39.56 FAN.P1 3.37,39.56 1.91,38.1 1.91,22.86 2.54,22.23 5.08,19.69 7.62,19.69 9.53,17.78 9.53,15.24 11.81,12.95 5V_CONV.IN+ | 41.27,6.99 40,6.99 40,6.6 41.85,6.6 arc-90 43.18,5.28 43.18,3.81 arc90 45.09,1.91 55.3,1.91 arc90 v57.63,4.24
  Bottom 2.54: 40,6.99 18.85,6.99 arc-90 16.41,9.42
  pour Top (isolate 0.406, rank 2, no thermals): 11.3,10.11 15.42,13.74 17.2,11.96 14.27,8.56
  pour Bottom (isolate 0.152, no thermals): 15.47,12.01 15.21,9.45 17.6,9.53 17.3,12.01
BAT_LVL  (via drill 0.35)
  Top 0.305: STM32F103CB.10 29.64,19.59 29.92,19.3 29.92,18.29 29.41,17.78 v28.35,17.78 | 2.49,22.86 1.91,22.86 1.27,23.5 1.27,28.58 2.46,29.77 7.59,29.77 7.87,29.49 16.48,29.49 16.51,29.46 16.64,29.34 v17.4,29.34
  Top 0.508: R34.1 2.49,22.86 2.49,23.86 R35.2
  Bottom 0.406: v28.35,17.78 27.08,16.51 26.04,16.51 21.08,21.46 20.62,21.46 18.24,23.85 18.24,28.5 v17.4,29.34
FRONT_LIGHT  (via drill 0.35)
  Top 0.305: STM32F103CB.27 38.83,19.59 v40.34,18.09
  Top 0.406: v76.84,2.54 78.11,2.54 78.85,3.29 R6.1
  Bottom 0.406: v40.34,18.09 38.69,19.73 38.69,20.39 39.12,20.82 39.73,20.82 41.02,19.53 46,19.53 49.55,23.09 53.29,23.09 57.23,19.15 61.62,19.15 63.5,21.03 67.11,21.03 69.95,18.19 73.76,18.19 74.93,17.02 74.93,4.44 v76.84,2.54
GND  (via drill 0.35, 0.5 pad 1.3)
  Top 0.254: 49.05,39.06 RPI_ZERO.15 | C14.2 C8.2 | U3.18 51.16,30.24 C6.2 53.98,29.84
  Top 0.305: 30.82,22.86 STM32F103CB.47 30.82,27.11 31.27,27.56 31.27,31.88 | STM32F103CB.23 35.32,19.92 32.38,22.86 30.82,22.86 | STM32F103CB.8 30.11,20.59 30.82,21.3 30.82,22.86 | STM32F103CB.35 36.66,23.59 36.47,23.78 36.47,24.36 36.67,24.56 38,24.56 v38.46,25.02 | 31.27,31.88 C40.2 28.07,31.88 27.71,31.52 R30.2 | 38.58,14.12 arc-90 v38.1,13.97 | C39.2 43.59,15.88 | 37.46,13.97 v38.1,13.97 | STM32F103CB.23 35.32,16.14 | 37.49,13.97 v38.1,13.97 | R1.2 32.38,33.15 31.27,31.88 | R8.1 50.93,22.35 51.1,22.17 51.1,21.39 50.62,20.9 47.62,20.9 46.99,21.54 46.99,25.4 49.53,27.94 53.34,27.94 53.98,28.58 53.98,29.84 53.98,30.48 55.24,31.75 59.69,31.75 | C37.1 21.56,29.21 | STM32F103CB.23 35.32,15.33 36.68,13.97 v38.1,13.97
  Top 0.406: 60.53,14.61 59.69,14.61 59.55,14.46 U5.4 59.55,7.97 C12.- | 60.96,33.66 59.69,32.38 59.69,31.75 59.69,31.52 62.86,28.34 62.86,27.94 63.5,27.3 65.62,27.3 | 65.62,27.3 R10.1 R4.1 | 65.62,27.3 R7.1 | v38.46,25.02 38.46,26.39 38.73,26.67 | C38.2 38.86,26.8 38.73,26.67 | R12.1 R8.1 R14.1 | C7.2 44.71,29.72 C17.2 | 1.8V_CONV.1 38.63,31.12 38.1,31.12 37.46,30.48 37.46,27.94 38.73,26.67 | M1.2 66.73,38.2 RPI_ZERO.1 | 20.32,29.21 19.69,28.58 19.69,20.85 20.35,20.19 23.83,20.19 C36.1 | 20.32,29.21 21.71,29.21 C37.1 | 20.32,29.21 v19.69,29.84 | INA219.8 9.19,28.44 9.53,28.78 9.83,28.47 INA219.7 | INA219.3 10.48,23.8 v10.82,23.47 | LED1.1 25.37,32.55 25.4,32.51
  Top 0.508: RPI_ZERO.1 65.46,40.44 60.38,40.44 RPI_ZERO.8 57.84,40.44 55.3,40.44 RPI_ZERO.12 52.76,40.44 50.22,40.44 RPI_ZERO.15 47.68,40.44 42.6,40.44 RPI_ZERO.22 | RPI_ZERO.28 32.44,40.44 29.9,40.44 RPI_ZERO.31 27.33,40.46 24.79,40.46 RPI_ZERO.36 | C34.- 20.98,32.41 | 13.35,34.28 PCA9533.4 13.35,34.3 15.19,36.15 C43.- 15.19,38.15 13.75,39.59 M2.2 | 31.62,10.39 v31.88,10.39 30.72,11.55 30.71,11.55 30.47,11.79 30.47,11.8 27.16,15.11 C33.2 | M3.2 79.06,6.67 79.68,7.29 79.68,10.31 v79.17,10.82 | 9.53,28.78 8.81,28.78 v7.77,27.74
  Top 0.61: L_L293DD.17 L_L293DD.4 60.68,16.36 60.53,16.51 | L_L293DD.16 L_L293DD.5 60.68,15.09 60.53,15.24 | L_L293DD.15 L_L293DD.6 60.68,13.82 60.53,13.97 | L_L293DD.14 L_L293DD.7 60.6,12.55 60.53,12.62 60.53,13.97 | v12.7,34.92 13.32,34.3 13.35,34.3 | 60.53,13.97 60.53,14.61 60.53,15.24 | 60.53,15.24 60.53,16.51 | 56.52,15.24 56.52,13.97 | 56.52,13.97 56.52,12.7 56.36,12.55 R_L293DD.14 R_L293DD.7 43.97,12.55 43.59,12.93 43.59,13.97 | 56.52,15.24 56.36,15.09 R_L293DD.16 R_L293DD.5 43.74,15.09 43.59,15.24 | 56.52,13.97 56.36,13.82 R_L293DD.15 R_L293DD.6 43.74,13.82 43.59,13.97 | 56.52,15.24 60.53,15.24 | 43.59,13.97 43.59,15.24 | 43.59,15.24 43.59,15.88 43.59,16.21 43.74,16.36 R_L293DD.4 R_L293DD.17 56.52,16.36 | 56.52,16.36 56.57,16.41 56.57,18.47 57.17,19.07 59.86,19.07 | 56.52,16.36 56.52,15.24 | C4.2 C9.2 59.82,19.11 59.86,19.07 | 59.86,19.07 60.53,18.4 60.53,16.51 | C3.- 40.49,13.82 arc-90 40.64,13.97 | 1.8V_CONV.1 39.67,33.2 C14.2 40.77,33.66 C17.2 | RPI_ZERO.31 29.85,37.95 C40.2 29.22,32.51 25.4,32.51 C34.- | PWR.2 8.37,10.84 9.55,12.01 9.55,17.86 7.75,19.66 6.96,19.66 6.1,20.52 6.1,25.15 6.65,25.7 v6.73,25.7
  Top 0.813: 4.59,22.66 C24.2 4.64,25.6 4.63,25.62 R35.1 | C16.2 5.1,6.48 C27.- 5.08,8.25 5.71,8.89 PWR.2 | I2C.3 60.96,33.66 64.14,30.48 67.54,30.48 68.58,29.44 C5.2 C2.2 73.53,26.16 74.3,25.4 74.3,24.77 74.93,24.13 77.33,24.13 LDIAR.P4 | C1.2 C33.2
  Top 1.016: C23.2 C24.2 | 5V_CONV.IN- 18.42,5.59 C15.2 | 31.88,6.35 31.75,6.22 C13.2 26.44,6.22 25.8,6.87 3.3V_CONV.1 | C10.- 68.68,40.36 68.3,39.98 68.3,39.24 68.22,39.17 RPI_ZERO.1 | v19.43,33.66 19.48,32.51 C34.-
  Top 1.27: 5V_CONV.IN- 16.51,3.68 | C23.2 4.59,20.17 6.35,18.41 7.26,18.41 8.26,17.42 8.26,13.34 6.39,11.47 PWR.2 | v38.1,13.97 40.64,13.97 43.59,13.97 | v7.77,27.74 6.55,27.74 4.64,25.83 C24.2
  Top 1.778: 5V_CONV.OUT- 31.88,6.35 v31.88,10.39
  Bottom 0.305: 32.35,4.02 5V_CONV.OUT-
  Bottom 0.406: v10.82,23.47 10.41,23.88 7.09,23.88 6.07,24.89 6.07,26.04 v7.77,27.74
  Bottom 0.61: v38.46,25.02 38.48,25.02 39.37,24.13 | v12.7,34.92 13.97,33.66 | RPI_ZERO.1 65.18,37.62 60.96,37.64 I2C.3 | 79.53,24.13 79.53,15.09 79.63,14.99 79.63,11.28 v79.17,10.82 | v19.69,29.84 19.05,30.48 16.71,30.48 16.33,30.1 16.33,27.76 15.16,26.59 7.62,26.59 v6.73,25.7
  Bottom 0.813: 73.03,31.12 73.16,31.25 78.58,31.25 79.53,30.3 79.53,24.13 79.43,24.04 LDIAR.P4 | 5V_CONV.OUT- 33.53,1.91 40.64,1.91 41.27,2.54 J1.1 | GND.TP 11.29,31.26
  Bottom 1.27: v31.88,10.39 33.25,10.39 36.5,13.64 | RPI_ZERO.1 68.15,39.17 73.03,34.29 73.03,31.12 73.03,30.68 68.38,26.04 48.13,26.04 46.22,24.13 39.37,24.13 36.5,21.26 36.5,13.64 | v19.43,33.66 13.97,33.66 13.69,33.66 11.29,31.26 v7.77,27.74 | v38.1,13.97 36.83,13.97 36.5,13.64
  Bottom 2.54: 5V_CONV.OUT- 5V_CONV.IN- 13.63,3.56 PWR.2
  pour Top (isolate 0.254, rank 3): -1.27,46.36 -1.27,-0.64 81.92,-0.64 81.92,46.36
  pour Bottom (isolate 0.254, rank 3): -2.54,-1.27 -2.54,47.62 83.19,47.62 83.19,-1.91 -2.54,-1.91
  pour Top (rank 2, no thermals): 60.96,16.51 60.96,12.4 73.03,12.4 73.03,16.51
  pour Top (rank 2, no thermals): 43.81,16.51 43.87,12.45 56.57,12.45 56.52,16.51
  pour Top (rank 3, no thermals): 59.69,10.8 59.69,13.34 60.32,13.34 60.32,10.8
  cutout Top: 52.7,36.83 47.62,36.83 arc90 46.99,36.2 46.99,31.12 arc90 47.62,30.48 52.7,30.48 arc90 53.34,31.12 53.34,36.2 arc90
  cutout Bottom: 53.34,31.75 53.34,36.2 arc90 52.7,36.83 47.62,36.83 arc90 46.99,36.2 46.99,31.75 arc90 47.62,30.48 52.7,30.48 arc90
  cutout Top: 18.42,31.12 18.54,30.78 30.61,30.78 30.48,31.12
  cutout Bottom: 8.89,27.3 14.61,27.3 14.71,27.3 15.62,28.22 15.62,30.12 15.62,30.43 16.28,31.09 19.69,31.09 20.35,30.43 20.55,30.23 20.55,29.72 20.55,29.39 20.17,29.01 19.28,29.01 19.08,29.21 18.92,29.36 18.92,29.57 18.75,29.74 17.32,29.74 17.22,29.74 17.07,29.59 17.07,27.81 17.09,27.79 17.09,27.53 15.67,26.11 15.47,25.91 8.05,25.91 7.04,24.89 6.55,24.89 6.48,24.89 5.99,25.37 5.99,26.04 6.07,26.11 7.26,27.3 8.18,27.3
  cutout Top: 6.38,26.37 5.31,25.3 5.31,20.29 6.71,18.9 7.65,18.9 8.84,17.7 8.84,12.95 7.98,11.99 7.75,11.71 7.32,10.49 7.62,10.16 8.79,10.16 10.44,11.81 10.44,18.16 8.13,20.47 7.24,20.47 6.83,20.88 6.83,24.77 7.39,25.32 7.44,25.32 7.44,26.11 7.47,26.14 7.24,26.37
INT_MD_1
  Top 0.305: STM32F103CB.21 34.32,14.57 36.3,12.6 36.3,7.37 37.64,6.02 J1.3
INT_MD_2
  Top 0.305: STM32F103CB.22 34.82,14.79 36.83,12.78 36.83,7.62 39.14,5.31 J1.2
LIDAR_POS_INT  (via drill 0.35)
  Top 0.305: STM32F103CB.25 38.36,18.59 v39.12,17.83
  Bottom 0.406: LDIAR.P3 71.76,26.04 69.47,23.75 49.17,23.75 45.64,20.22 41.3,20.22 40.06,21.46 38.76,21.46 37.9,20.6 37.9,19.05 v39.12,17.83
M_DIR_L_1  (via drill 0.35)
  Top 0.305: 66.85,18.9 66.85,20.14 64.77,22.23 64.77,25.19 R10.2 | STM32F103CB.39 34.82,23.59 v34.8,23.57
  Top 0.406: 63.92,26.25 R10.2 62.86,26.04 61.69,27.21 61.69,28.48 v60.96,29.21
  Top 0.61: L_L293DD.19 66.85,18.9 | 66.85,18.9 L_L293DD.2 | 66.89,18.94 66.85,18.9
  Bottom 0.406: v34.8,23.57 35.64,24.41 35.64,25 37.61,26.98 46.09,26.98 47.26,28.14 59.89,28.14 v60.96,29.21
M_DIR_L_2  (via drill 0.35)
  Top 0.305: STM32F103CB.38 35.32,26.96 v34.75,27.53
  Top 0.406: v68.58,20.96 66.85,22.68 66.85,29.16 66.37,29.64 64.99,29.64 R7.2 63.92,28.79 v60.96,31.75
  Top 0.61: L_L293DD.9 L_L293DD.12 72.85,10.01 arc90 73.66,10.82 v73.66,19.13
  Bottom 0.406: v73.66,19.13 70.41,19.13 v68.58,20.96 | v34.75,27.53 45.86,27.53 47.02,28.7 58.8,28.7 60.96,30.86 v60.96,31.75
M_DIR_R_1  (via drill 0.35)
  Top 0.305: STM32F103CB.14 30.82,19.72 v30.84,19.74
  Top 0.406: 52.7,18.9 52.7,20.96 53.36,21.62 54,21.62 54.61,22.23 54.61,24.44 54.06,24.98 R14.2 52.96,25.96 53.29,26.29 55.5,26.29 57.78,28.58 v57.78,30.48
  Top 0.61: R_L293DD.2 52.7,18.9 R_L293DD.19
  Bottom 0.406: v30.84,19.74 30.84,22.58 32.59,24.33 32.59,28.14 33.83,29.39 45.34,29.39 46.33,30.38 54.11,30.38 54.94,31.21 57.05,31.21 v57.78,30.48
M_DIR_R_2  (via drill 0.35)
  Top 0.305: v31.9,21.39 31.93,21.36 31.93,19.41 31.32,18.8 STM32F103CB.15
  Top 0.406: v55.24,30.48 55.24,28.58 54.08,27.41 50.27,27.41 48.89,26.04 R12.2 47.89,24.98 47.5,24.59 47.5,22.66 48.54,21.62 v50.19,21.62
  Top 0.61: R_L293DD.9 R_L293DD.12 v56.59,10.01
  Bottom 0.406: v56.59,10.01 53.34,13.26 53.34,20.32 52.04,21.62 v50.19,21.62 | v31.9,21.39 31.9,22.86 33.15,24.1 33.15,27.91 34.06,28.83 45.57,28.83 46.56,29.82 54.59,29.82 v55.24,30.48
N$1  (via drill 0.35)
  Top 0.813: R_L293DD.8 v47.55,11.28
  Bottom 0.813: v47.55,11.28 47.55,8.41 45.43,6.29 MOTOR_R_B.P2
N$2  (via drill 0.35)
  Top 0.813: R_L293DD.18 v50.01,17.63
  Bottom 0.813: MOTOR_R_F.P2 52.41,6 52.07,6.35 50.8,6.35 50.01,7.14 v50.01,17.63
N$3  (via drill 0.35)
  Top 0.813: R_L293DD.13 v51.33,11.28
  Bottom 0.813: v51.33,11.28 51.33,8.1 51.89,7.54 53.42,7.54 54.41,6.54 MOTOR_R_F.P1
N$4  (via drill 0.35)
  Top 0.813: L_L293DD.18 v68.78,17.63
  Bottom 0.813: v68.78,17.63 68.78,9.32 71.47,6.64 MOTOR_L_F.P2
N$5
  Top 0.305: 32.32,29.57 R1.1 32.32,29.72 STM32F103CB.44
N$6
  Top 0.508: R3.2 76.75,16.6 77.47,15.88 77.47,14.46 FRONTLIGHT.P1
N$7
  Top 0.406: LED1.2 27.37,35.72 R5.1
N$8
  Top 0.203: U3.10 48.06,33.45 arc90 47.62,33.02 47.62,32.46 arc-90 47.07,31.9 45.74,31.9 arc90 C7.1
  Top 0.254: 45.85,32.52 C7.1
N$9
  Top 0.508: FRONTLIGHT.P2 77.42,11.48 78.11,10.8 M3.3
N$10
  Top 0.61: R6.2 arc90 R6.2 M3.1
N$16  (via drill 0.35)
  Top 0.813: L_L293DD.13 v69.8,11.28
  Bottom 0.813: MOTOR_L_F.P1 73.47,6.54 69.8,10.21 v69.8,11.28
N$17  (via drill 0.35)
  Top 0.813: L_L293DD.8 v66.27,11.28
  Bottom 0.813: v66.27,11.28 66.27,8.48 64.48,6.69 MOTOR_L_B.P2
N$18  (via drill 0.35)
  Top 0.61: 67.54,17.63 v67.56,17.65
  Top 0.813: L_L293DD.3 67.54,17.63
  Bottom 0.813: v67.56,17.65 67.56,7.87 66.48,6.79 MOTOR_L_B.P1
N$22
  Top 0.406: PCA9533.3 14.62,31.75 arc-45 14.53,31.55 arc-45 14.16,31.39 12.93,31.39 11.94,32.38 11.94,33.36 R26.1
  Top 0.508: 10.38,34.73 R26.1
N$23
  Top 0.406: R27.1 10.49,32.72 12.47,30.73 14.26,30.73 arc45 15.67,31.32 arc45 15.88,31.83 PCA9533.2
N$24
  Top 0.406: R28.1 10.73,30.12 16.15,30.12 17.15,31.12 PCA9533.1
  Top 0.508: 10.59,30.48 R28.1
N$26  (via drill 0.35)
  Top 0.813: R_L293DD.3 v48.74,17.63
  Bottom 0.813: MOTOR_R_B.P1 47.43,6.49 48.74,7.8 v48.74,17.63
N$31
  Top 0.406: RGB_LED.P4 8.52,34.77 R26.2
N$33
  Top 0.406: RGB_LED.P3 8.62,32.77 R27.2
  Top 0.508: 8.54,32.84 R27.2
N$35
  Top 0.406: RGB_LED.P2 6.06,30.77 6.35,30.48 R28.2
N$37
  Top 0.406: 15.43,42.73 R22.2 13.92,42.73 13.45,42.26 13,42.26 M2.1
N$38
  Top 0.406: R38.2 66.92,35.95 67.95,34.92 69.85,34.92 70.8,35.88 M1.1
N$39
  Top 0.813: LIDAR_MOTOR.P2 77.44,39.06 D1.A 75.61,33.02 70.66,33.02 M1.3
N$46
  Top 0.305: STM32F103CB.6 26.67,21.59 25.2,23.06 22.25,23.06 KX-9A.1 20.98,24.27
  Top 0.406: KX-9A.1 21.01,21.79 C36.2
N$47
  Top 0.305: STM32F103CB.5 27.44,22.09 26.67,22.86 26.67,26.04 26.21,26.5 KX-9A.3 | KX-9A.3 24.63,26.67 | 24.67,26.54 KX-9A.3
  Top 0.406: KX-9A.3 24.71,29.01 C37.2
N$49
  Top 0.305: STM32F103CB.2 27.9,23.59 arc-90 27.46,24.03 R30.1
N$55
  Top 0.813: 9.89,43.05 D3.A 12.18,42.69 M2.3 | 9.07,41.91 8.73,41.56
  Top 1.016: 9.58,42.42 D3.A 9.53,42.36 8.73,41.56 FAN.P2
NRST  (via drill 0.35)
  Top 0.305: STM32F103CB.7 26.62,21.09 v26.24,20.7
  Top 0.406: 22.66,18.03 22.66,18.34 C1.1 | R2.1 20.77,17.32 22.27,17.32 C1.1 | C1.1 24.53,19.58 25.12,19.58 v26.24,20.7
  Bottom 0.305: v26.24,20.7 27.85,22.31 27.94,22.4 28.07,22.53 28.07,25.22 30.23,27.38 30.23,35.94 31.75,37.47 | RPI_ZERO.26 34.98,40.44 34.98,38.38 34.06,37.47 31.75,37.47 | 29.85,37.47 31.75,37.47
PWM_FAN  (via drill 0.35)
  Top 0.305: STM32F103CB.18 v32.82,15.19
  Top 0.406: R22.1 15.65,39.93 18.31,37.26 18.31,22.33 v18.67,21.97
  Bottom 0.406: v32.82,15.19 arc-90 32.03,14.4 22.02,14.4 20.02,16.41 20.02,20.62 v18.67,21.97
PWM_LIDAR  (via drill 0.35)
  Top 0.305: STM32F103CB.19 33.32,18.08 33.66,18.41 v34.29,18.41
  Top 0.406: R38.1 66.82,34.29 66.04,34.29 65.51,33.76 v65.51,32.92
  Bottom 0.406: v34.29,18.41 35.51,19.63 35.51,21.67 36.85,23.02 36.85,24.64 38.03,25.81 46.5,25.81 47.72,27.03 62.59,27.03 65.51,29.95 v65.51,32.92
PWM_M_EN_L  (via drill 0.35)
  Top 0.305: STM32F103CB.16 31.82,15.77 v31.3,15.24
  Top 0.406: 61.59,20.14 61.62,20.12 61.67,20.17 L_L293DD.1 | v60.96,27.94 60.96,26.45 R4.2 63.17,22.75 63.17,20.17
  Top 0.61: L_L293DD.1 63.17,20.17 v64.77,20.17 | L_L293DD.11 v64.77,8.74
  Bottom 0.406: v31.3,15.24 33.38,17.32 33.38,18.59 34.95,20.17 34.95,21.9 36.2,23.15 36.2,24.77 37.79,26.37 46.27,26.37 47.49,27.58 60.6,27.58 v60.96,27.94
  Bottom 0.61: v64.77,20.17 v64.77,8.74
PWM_M_EN_R  (via drill 0.35)
  Top 0.305: STM32F103CB.17 32.32,18.35 32.84,18.87 v32.84,19.76 | R8.2 51.78,24.13 53.7,24.13 54,23.82 54,22.61 53.62,22.23 52.88,22.23 52.02,21.36 52.02,20.85 v51.33,20.17
  Top 0.406: 46.04,20.18 46.05,20.17 | R8.2 50.93,26.16 51.61,26.85 54.79,26.85 56.52,28.58 v56.52,30.48
  Top 0.61: R_L293DD.1 46.05,20.17 v51.33,20.17 | R_L293DD.11 v52.43,8.74
  Bottom 0.406: v32.84,19.76 32.84,23.01 33.71,23.87 33.71,27.53 34.44,28.27 45.8,28.27 46.79,29.26 55.93,29.26 56.52,29.84 v56.52,30.48
  Bottom 0.61: v51.33,20.17 52.43,19.07 v52.43,8.74
SCL  (via drill 0.35)
  Top 0.203: U3.23 52.64,34.26 arc90 53.36,34.98 53.36,35.33 arc90 v51.97,36.73
  Top 0.305: STM32F103CB.42 33.36,25.83 33.36,28.04 34.65,29.32 v34.65,32.13
  Top 0.406: INA219.5 11.13,26.97 12.06,26.04 12.06,25.4 12.89,24.57 13.78,24.57 | R29.2 13.78,22.29 14.38,21.69 15.67,21.69 17.04,20.32 18.29,20.32 19.79,18.82 19.79,18.44 20.17,18.06 v21.08,18.06
  Top 0.508: 14.61,25.49 PCA9533.6 14.61,25.4 13.78,24.57 R29.2
  Bottom 0.406: 34.65,32.94 33.1,32.94 31.75,31.59 31.75,24.77 29.85,22.86 29.85,17.14 27.94,15.24 25.4,15.24 22.58,18.06 v21.08,18.06 | v34.65,32.13 34.65,32.94 | 34.65,32.94 35.48,32.94 39.27,36.73 v51.97,36.73 53.44,36.73 54.61,35.56 I2C.1
SDA  (via drill 0.35)
  Top 0.203: U3.24 52.05,34.66 arc90 52.48,35.08 52.48,35.23 arc90 51.87,35.84 arc-90 51,36.7 v51,37.49
  Top 0.305: STM32F103CB.43 32.82,28.22 33.66,29.06 v33.66,34.92
  Top 0.406: INA219.6 10.48,28.42 10.77,28.7 14.83,28.7 arc-45 15.75,28.32 arc-45 15.88,28.01 PCA9533.7 | R20.2 15.36,23.18 | R20.2 15.36,23.05 | R20.2 17.54,21.08 18.62,21.08 20.55,19.15 v21.06,19.15
  Top 0.508: R20.2 15.36,24.25 15.88,24.77 PCA9533.7
  Bottom 0.406: v21.06,19.15 22.5,19.15 25.78,15.88 27.61,15.88 29.26,17.53 29.26,23.32 31.04,25.09 31.04,31.88 32.82,33.66 33.66,33.66 | v33.66,34.92 33.66,33.66 | 33.66,33.66 34.92,33.66 38.76,37.49 v51,37.49 57.76,37.49 arc-90 58.42,36.83 I2C.2
SWCLK
  Top 0.305: STM32F103CB.37 35.82,27.3 35.82,27.4 35.82,35.82 37.46,37.47 37.46,42.14 38.51,43.18 42.39,43.18 RPI_ZERO.20
SWDIO
  Top 0.305: RPI_ZERO.24 40.08,40.41 40.08,38.18 39.01,37.11 38.38,37.11 36.58,35.31 36.58,25.21 35.94,24.57 35.94,23.55 36.4,23.09 STM32F103CB.34
TEMPERATURE  (via drill 0.35)
  Top 0.305: STM32F103CB.28 v39.41,20.09 | v39.41,20.09 v39.42,20.09 | R25.1 40.02,20.09 v39.41,20.09
  Top 0.406: U5.1 57.6,10.78 v57.61,10.77
  Bottom 0.406: v39.42,20.09 40.77,18.75 46.2,18.75 49.84,22.38 52.93,22.38 57.61,17.7 v57.61,10.77
U1_RX  (via drill 0.35)
  Top 0.305: STM32F103CB.31 38.73,21.59 39.37,22.23 41.91,22.23 v42.54,22.86
  Bottom 0.406: LDIAR.P1 73.95,30.04 68.96,25.04 48.54,25.04 46.35,22.86 v42.54,22.86
U1_TX  (via drill 0.35)
  Top 0.305: STM32F103CB.30 38.97,21.09 39.5,21.62 42.82,21.62 v43.18,21.97
  Bottom 0.406: 48.87,24.38 48.89,24.38 | 48.89,24.38 69.22,24.38 72.87,28.04 LDIAR.P2 | 48.89,24.38 46.48,21.97 v43.18,21.97
USART2_RX  (via drill 0.35)
  Top 0.305: STM32F103CB.13 30.32,16.07 arc-90 29.95,15.7 28.98,15.7 v27.03,17.65
  Bottom 0.305: RPI_ZERO.34 26.09,41.33 24.77,40.01 24.77,37.47 29.11,33.12 29.11,27.76 27,25.65 27,23.34 24.84,21.18 24.84,19.84 v27.03,17.65
USART2_TX  (via drill 0.35)
  Top 0.305: STM32F103CB.12 v27.24,18.59 v27.23,18.59
  Bottom 0.305: RPI_ZERO.32 27.33,40.41 27.33,38.28 29.64,35.97 29.64,27.51 27.51,25.38 27.51,23.06 25.4,20.96 25.4,20.32 27.13,18.59 v27.23,18.59
V+
  Top 0.406: INA219.1 9.19,20.03 10.49,18.72 10.49,3.68 | PWR.1 2.54,12.66 2.54,4.44 3.33,3.66 C27.+ 5.1,3.68 C16.1 10.49,3.68 | 10.49,3.68 R17.2
  Top 0.61: R34.2 2.49,19.05 2.5,19.05 PWR.1
  pour Top (isolate 0.406, rank 2, no thermals): 5.05,16.97 3.56,14.99 arc45 1.14,8 1.3,5.18 arc45 2.14,3.12 arc49 4.99,2.15 11.23,2.92 11.1,4.42 6.48,4.5 arc-17 4.51,4.56 arc-71 3.55,5.04 3.52,9.06 arc-42 5.56,14.41 6.48,16.15
(copper drawn outside any net)
  shapes: Top area x2

### Text on the board
tNames: + | - + | - | 5v I1 I2 GND
bNames: 5v GND SDA SCL | ζ2 Motherboard